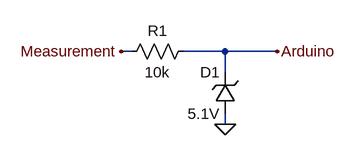
[diagram p0: schematic protection_diodes.asc]
protection_diodes.asc, the LTspice schematic file:
Version 4
SHEET 1 880 680
WIRE 64 144 48 144
WIRE 208 144 144 144
WIRE 288 144 208 144
WIRE 208 176 208 144
WIRE 208 256 208 240
FLAG 208 256 0
FLAG 288 144 Arduino
FLAG 48 144 Measurement
SYMBOL zener 224 240 R180
WINDOW 0 24 64 Left 2
WINDOW 3 24 0 Left 2
SYMATTR InstName D1
SYMATTR Value 5.1V
SYMBOL res 160 128 R90
WINDOW 0 0 56 VBottom 2
WINDOW 3 32 56 VTop 2
SYMATTR InstName R1
SYMATTR Value 10k

The netlist it stands for:
* protection_diodes.asc
D1 0 Arduino 5.1V
R1 Arduino Measurement 10k
.model D D
.lib standard.dio
.backanno
.end